# EAGLE design LED-BLEBoard (EAGLE 7.2.0)
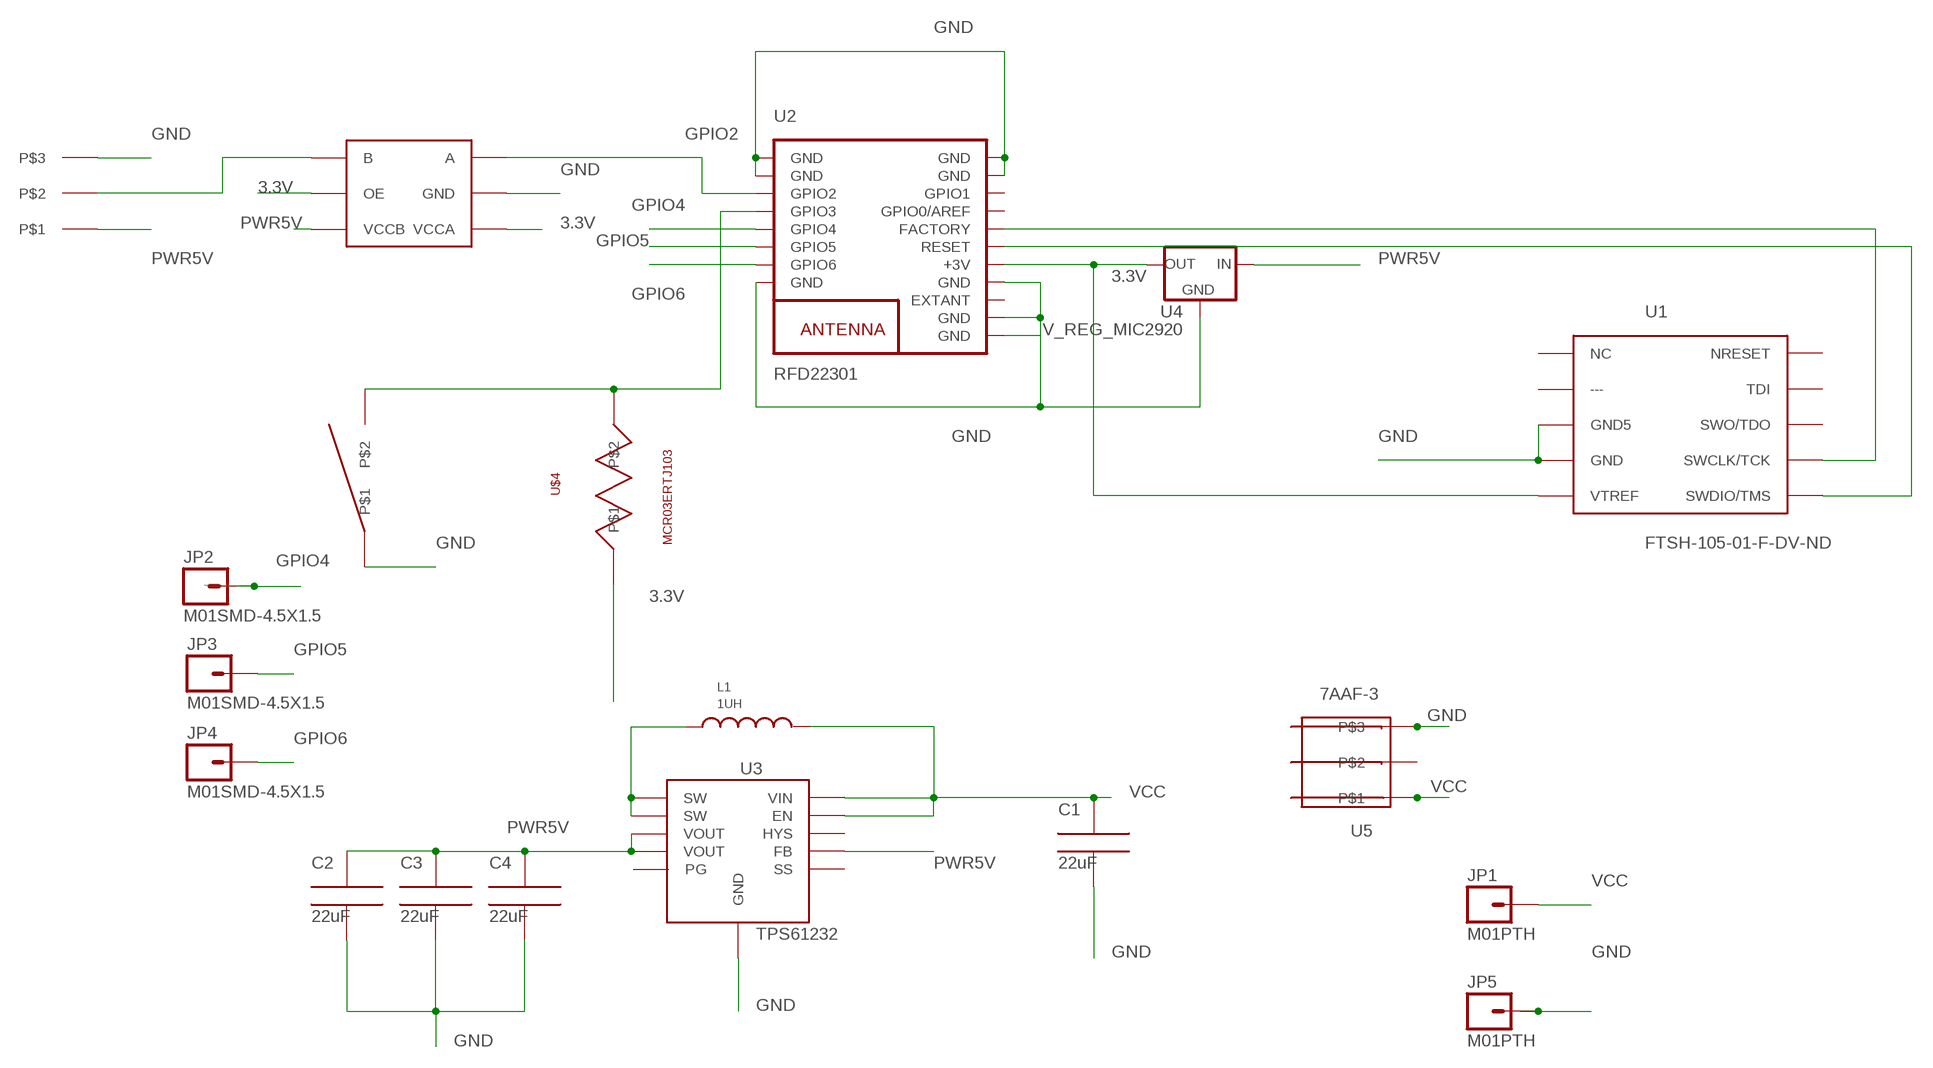
[diagram p0: schematic, sheet 1]

## Parts
C1  22uF  C1.6X0.8MM  [C1.6X0.8]
C2  22uF  C1.6X0.8MM  [C1.6X0.8]
C3  22uF  C1.6X0.8MM  [C1.6X0.8]
C4  22uF  C1.6X0.8MM  [C1.6X0.8]
JP1  M01PTH  [1X01]
JP2  M01SMD-4.5X1.5  [PAD-1.5X4.5]
JP3  M01SMD-4.5X1.5  [PAD-1.5X4.5]
JP4  M01SMD-4.5X1.5  [PAD-1.5X4.5]
JP5  M01PTH  [1X01]
L1  1UH  SRP5030T  [SRP5030T]
U1  FTSH-105-01-F-DV-ND  FTSH-105-01-XXX-DV-K  [FTSH-105-01-XXX-DV-K]
U2  RFD22301  [RFD22301]
U3  TPS61232  TPS61232VSON  [VSON10]
U4  V_REG_MIC2920  [SOT223]
U5  7AAF-3  [70AAJ-3]
U$1  MM800  [MM800]
U$2  TXS0101TXS0101DBVR  [TXS0101DBVR]
U$3  PTS840  [PTS840GK]
U$4  MCR03ERTJ103  [C1.6X0.8]

## Nets
3.3V: U1.VTREF U2.13(+3V) U4.3(OUT) U$2.P$1(VCCA) U$2.P$5(OE) U$4.IN
GND: C1.IN C2.IN C3.IN C4.IN JP5.1 U1.GND U1.GND5 U2.1(GND) U2.2(GND) U2.8(GND) U2.9(GND) U2.10(GND) U2.12(GND) U2.18(GND) U2.19(GND) U3.P$11(GND) U4.2(GND) U5.P$3@1 U5.P$3@3 U$1.P$3 U$2.P$2(GND) U$3.P$1
GPIO2: U2.3(GPIO2) U$2.P$3(A)
GPIO4: JP2.P$1 U2.5(GPIO4)
GPIO5: JP3.P$1 U2.6(GPIO5)
GPIO6: JP4.P$1 U2.7(GPIO6)
N$1: U1.SWCLK/TCK U2.15(FACTORY)
N$2: U2.4(GPIO3) U$3.P$3 U$4.OUT
N$3: U1.SWDIO/TMS U2.14(RESET)
N$10: U$1.P$2 U$2.P$4(B)
PWIND: L1.P$1(IN) U3.P$1(SW) U3.P$2(SW)
PWR5V: C2.OUT C3.OUT C4.OUT U3.P$3(VOUT) U3.P$4(VOUT) U3.P$7(FB) U4.1(IN) U$1.P$1 U$2.P$6(VCCB)
VCC: C1.OUT JP1.1 L1.P$2(OUT) U3.P$9(EN) U3.P$10(VIN) U5.P$1@1 U5.P$1@2
Unconnected: U1.--- U1.NC U1.NRESET U1.SWO/TDO U1.TDI U2.11(EXTANT) U2.16(GPIO0/AREF) U2.17(GPIO1) U3.P$5(PG) U3.P$6(SS) U3.P$8(HYS) U5.P$2@1 U5.P$2@2

## Library data of the parts
C1-C4 = bret:C1.6X0.8MM
JP1-JP5 = SparkFun-Connectors:M01: Header 1 Standard 1-pin 0.1" header. Use with straight break away headers (SKU : PRT-00116), right angle break away headers (PRT-00553), swiss pins (PRT-00743), machine pins (PRT-00117), and female headers (PRT-00115).
L1 = bret:SRP5030T: SRP5030T Series - Shielded Power Inductors Features ■ Shielded construction ■ Iron powder core ■ High saturation current ■ Inductance range: 0.33 to 10 μH ■ Rated current up to 14 A ■ RoHS compliant* and halogen free** http://www.digikey.com/product-detail/en/SRP5030T-1R0M/SRP5030T-1R0MCT-ND/3986021
U1 = bret:FTSH-105-01-XXX-DV-K: 9-pin 0.05'' Samtec FTSH connector as defined by ARM.
U2 = RF_Digital_RFD22301_Eagle_Schematic_PCB_Library:RFD22301: RFD22301 RFduino SMT Module RFD22301 Datasheet: http://www.rfdigital.com/wp-content/uploads/2014/03/RFD22301.Data_.Sheet_.11.24.13_11.38PM.pdf
U3 = bret:TPS61232: TPS61232 High Efficiency Synchronous Step Up Converters 3.3v -> 5v 2.1amp
U4 = SparkFun-PowerIC:V_REG_MIC2920: MIC2920A (http://www.micrel.com/_PDF/mic2920.pdf) - 400mA output LDO Regulator http://www.digikey.com/product-detail/en/MIC5200-3.3YS/576-1247-ND/771716
U5 = bret:7AAF-3: 7AAF-3 Female Connecting Pad http://www.bourns.com/data/global/PDFs/70AAF.pdf
U$1 = bret:MM800
U$2 = bret:TXS0101: TTi TXS0101 Logic Level shifter from ~3v to ~5v operation http://www.ti.com/lit/ds/symlink/txs0101.pdf
U$3 = bret:PTS840
U$4 = bret:MCR03ERTJ103: Resistor SMD 10K OHM 5% 1/10W 0603

## Net classes
0 default: clearance 0.205 mm

## Board
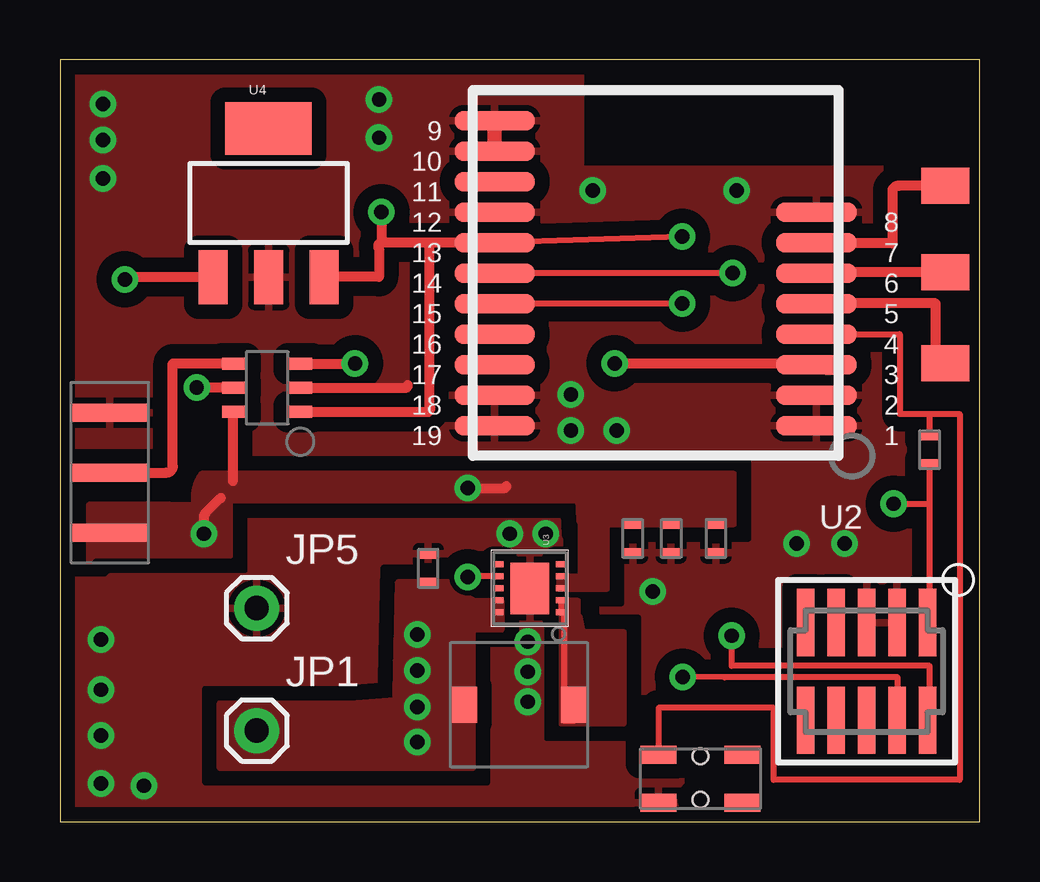
[diagram p1: board, top side]
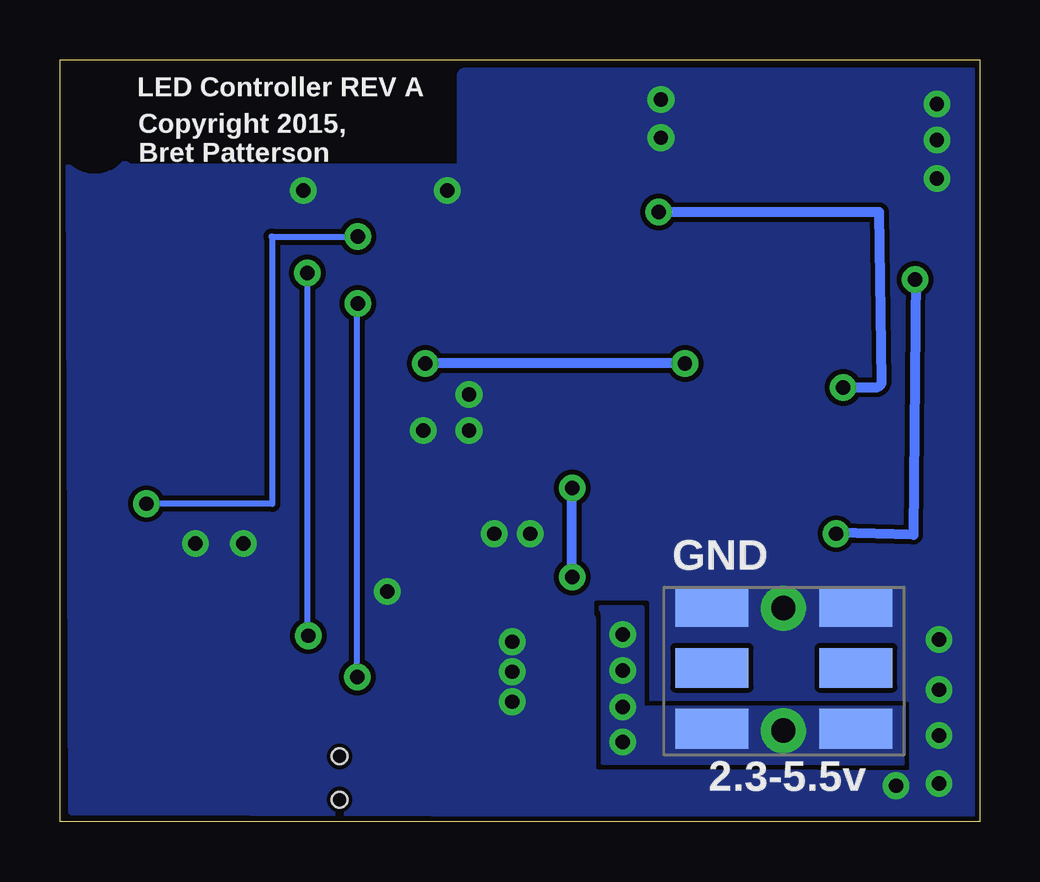
[diagram p2: board, bottom side, seen from below]

Size 38.35 x 31.74 mm. Coordinates in mm from the lower left corner, seen from the top.
Outline: 0,0 38.35,0 38.35,31.74 0,31.74 0,0
Copper layers (1*16): Top 0.035mm / dielectric 1.5mm / Bottom 0.035mm
Design rules "SparkFun *": minimum track width 8mil, minimum drill 20mil, track to track 8mil, track to pad 8mil, pad to pad 8mil, via to via 8mil, smd to smd 8mil, copper to edge 8mil, drill to drill 8mil, minimum pad ring 12mil, minimum via ring 10mil, stop-mask expansion 4mil, vias tented up to drill 0.7mm, thermal gap 10mil

### Footprints (pad centres in the part's own frame; a part is rotated, then mirrored left to right if it is on the bottom)
C1.6X0.8 = smd 0.4 x 0.8: IN -0.6,0; OUT 0.6,0
1X01 = drill 1.016 pad 1.88: 1 0,0
PAD-1.5X4.5 = smd 1.5 x 2: P$1 0,0
SRP5030T = smd 1.1 x 1.5: P$1 -2.3,0; P$2 2.3,0
FTSH-105-01-XXX-DV-K = smd 0.737 x 2.794: --- 1.27,-2.032; GND -1.27,-2.032; GND5 0,-2.032; NC 2.54,-2.032; NRESET 2.54,2.032; SWCLK/TCK -1.27,2.032; SWDIO/TMS -2.54,2.032; SWO/TDO 0,2.032; TDI 1.27,2.032; VTREF -2.54,-2.032
RFD22301 = smd 3.353 x 0.813: 1 -6.706,7.62; 2 -6.706,6.35; 3 -6.706,5.08; 4 -6.706,3.81; 5 -6.706,2.54; 6 -6.706,1.27; 7 -6.706,0; 8 -6.706,-1.27; 9 6.706,-5.08; 10 6.706,-3.81; 11 6.706,-2.54; 12 6.706,-1.27; 13 6.706,0; 14 6.706,1.27; 15 6.706,2.54; 16 6.706,3.81; 17 6.706,5.08; 18 6.706,6.35; 19 6.706,7.62
VSON10 = smd 0.24 x 0.4: P$1 -1,-1.3; P$2 -0.5,-1.3; P$3 0,-1.3; P$4 0.5,-1.3; P$5 1,-1.3; P$6 1,1.3; P$7 0.5,1.3; P$8 0,1.3; P$9 -0.5,1.3; P$10 -1,1.3 | smd 2.15 x 1.6: P$11 0,0
SOT223 = smd 1.219 x 2.235: 1 -2.311,-3.099; 2 0,-3.099; 3 2.311,-3.099 | smd 3.6 x 2.2: 4 0,3.099
70AAJ-3 = smd 1.65 x 3.048: P$1@1 -5.905,1.995; P$1@2 -5.905,8.005; P$2@1 -3.365,1.995; P$2@2 -3.365,8.005; P$3@1 -0.825,1.995; P$3@3 -0.825,8.005
MM800 = smd 0.75 x 3.25: P$1 1.25,1.625; P$2 3.75,1.625; P$3 6.25,1.625
TXS0101DBVR = smd 0.5 x 1: P$1 0.5,-0.5; P$2 1.5,-0.5; P$3 2.5,-0.5; P$4 2.5,2.25; P$5 1.5,2.25; P$6 0.5,2.25
PTS840GK = smd 0.75 x 1.5: P$1 0.25,4.25; P$2 0.25,0.75; P$3 2.25,4.25; P$4 2.25,0.75 | hole 0.65: 0.375,2.5; 2.175,2.5

### Placement (x,y rotation side)
C1  15.35,10.56 270 top
C2  25.48,11.8 90 top
C3  27.35,11.8 90 top
C4  23.88,11.8 90 top
JP1  8.2,3.8 0 top
JP2  36.9,19.1 90 top
JP3  36.9,22.9 90 top
JP4  36.9,26.5 90 top
JP5  8.2,8.9 0 top
L1  19.14,4.87 180 top
U1  33.62,6.27 180 top
U2  24.83,24.13 180 top
U3  19.59,9.72 90 top
U4  8.7,25.79 0 top
U5  3.17,9.78 90 bottom
U$1  3.7,10.8 90 top
U$2  9.52,16.58 90 top
U$3  29.2,0.55 90 top
U$4  36.25,15.5 90 top

### Tracks (layer width: path | path; a pad name or v marks a point on that pad's centre or on a via)
3.3V  (via drill 0.6)
  Top 0.254: 36.2,8.3 U1.VTREF 36.25,8.3 36.25,13.25 | v25.94,24.38 U2.13 | 36.25,13.25 U$4.IN | v34.75,13.25 36.25,13.25
  Top 0.406: 15.4,24.13 U2.13 arc-90 18.19,24.2 | 15.4,24.13 13.4,24.13 | 13.4,24.13 13.35,24.13 arc90 13.3,23.88 13.3,22.7 U4.3 arc90 U4.3 | U$2.P$1 15.35,17.08 arc90 15.4,17.33 15.4,24.13 | U$2.P$5 5.72,18.08 arc-90 v5.7,18.1 | v13.4,25.4 13.4,24.13
  Bottom 0.254: 29.5,24.38 v25.94,24.38 | 29.54,24.38 29.5,24.38 | 29.5,24.38 29.5,13.25 v34.75,13.25
  Bottom 0.406: v5.7,18.1 4.35,18.1 arc-90 4.1,18.35 4.2,25.4 v13.4,25.4
GND  (via drill 0.6)
  Top 0.406: U$2.P$2 14.38,18.08 arc90 14.5,18.2
  Top 0.61: U2.9 U2.10
  other vias: 1.8,29.9 1.8,28.4 1.8,26.8 3.5,1.5 1.7,1.6 1.7,3.6 21.3,17.8 21.3,16.3 1.7,5.5 1.7,7.6 13.3,30.1 13.3,28.5 23.2,16.3 22.2,26.3 28.2,26.3 24.7,9.6 30.7,11.6 32.7,11.6 19.5,7.5 19.5,6.25 20.25,12 18.75,12 19.5,5
  pour Top (isolate 0.61, rank 5): 37.96,0.47 37.96,27.18 21.7,27.2 21.7,31.18 0.34,31.28 0.34,27.2 0.27,0.27
  pour Bottom (rank 5, no thermals): 0.3,0.3 0.3,31.3 21.45,31.3 arc-90 21.7,31.05 21.7,27.3 35.5,27.3 arc-90 35.7,27.4 arc90 38,27.3 37.9,0.4
GPIO2  (via drill 0.6)
  Top 0.406: U$2.P$3 12.28,19.08 arc90 v12.3,19.1 | v23.12,19.1 32.79,19.1 arc-90 U2.3
  Bottom 0.406: v12.3,19.1 v23.12,19.1
GPIO4
  Top 0.406: JP2.P$1 36.75,19.1 arc-90 36.5,19.35 36.5,21.6 U2.5 arc90 U2.5
GPIO5
  Top 0.406: JP3.P$1 31.58,22.9 arc90 U2.6
GPIO6
  Top 0.406: JP4.P$1 34.95,26.5 arc90 34.7,26.25 34.7,24.1 31.57,24.1 arc-90 U2.7
N$1  (via drill 0.6)
  Top 0.254: U1.SWCLK/TCK 34.92,4.24 34.92,6.02 27.71,6.02 v25.96,6.04 | v25.94,21.59 U2.15
  Bottom 0.254: v25.96,6.04 25.96,21.59 v25.94,21.59
N$2
  Top 0.254: U2.4 35,20.32 35,17 36.25,17 | 36.25,17 37.5,17 37.5,1.75 29.75,1.75 29.75,4.75 24.95,4.75 U$3.P$3 | U$4.OUT 36.25,17
N$3  (via drill 0.6)
  Top 0.254: 36.2,4.24 U1.SWDIO/TMS 36.25,4.24 36.25,6.5 28,6.5 v28,7.75 | v28.04,22.86 U2.14
  Bottom 0.254: v28,7.75 28.04,7.75 v28.04,22.86
N$10
  Top 0.406: U$1.P$2 4.45,14.55 arc90 4.7,14.8 4.7,19.1 7.25,19.1 arc-90 U$2.P$4
PWIND
  Top 0.254: U3.P$2 U3.P$1 arc-90 21,8.61 21,4.2 21.4,4.2 arc90 21.44,4.24 L1.P$1
  pour Top (no thermals): 20.9,9.2 20.9,4.1 23.5,4.1 23.5,7.9 21.8,7.9 21.67,8.53 arc-45 21.6,8.61 21.6,9.2
PWR5V  (via drill 0.6)
  Top 0.254: U3.P$7 17.02,10.22 arc90 v17,10.2
  Top 0.406: 17.02,10.22 arc90 v17,10.2 | v17,13.9 18.5,13.9 arc90 18.6,14 | U$2.P$6 arc90 7.2,17.01 7.2,14.2 | U4.1 2.65,22.69 arc90 2.8,22.63 v2.7,22.6 | v6,12 6,12.7 arc-45 6.07,12.87 6.7,13.5
  Bottom 0.406: v17,10.2 v17,13.9 | v2.7,22.6 arc-90 2.67,22.82 2.77,11.95 5.95,12.05 arc-90 v6,12
  pour Top (no thermals): 1.2,13.2 1.2,10.9 1.33,11.03 arc-45 1.51,11.1 7.1,11.1 7.1,13.4 21.6,13.4 21.63,12.57 arc-45 21.7,12.39 21.7,10.2 20.8,10.2 20.8,9.7 22.8,9.7 22.8,12.4 28.1,12.4 28.1,14.5 5.9,14.5 5.87,14.47 arc45 5.6,13.19 4.6,13.2
VCC  (via drill 0.6)
  other vias: 14.9,7.8 14.9,6.3 14.9,3.33 14.9,4.78
  pour Top (no thermals): 15.2,9.9 16.1,9.9 17.3,9.2 18.4,9.2 18.4,8 17.2,8 17.2,2.23 6.66,2.23 6.66,4.95 12.06,4.95 13.97,5.08 13.97,4.45 14.1,10 16.3,10
  pour Bottom (no thermals): 3.25,4.7 14.1,4.7 14.1,8.9 15.8,8.9 15.77,8.87 arc45 15.7,8.69 15.7,2.5 9.9,2.5 3.25,2.46

### Text on the board
bPlace: LED Controller REV A | Copyright 2015, / Bret Patterson | GND | 2.3-5.5v
tDocu: GPIO6 | GPIO5 | GPIO4 | R1 | C1 | C1 | C1 | C1 | GND